# EAGLE schematic gameoflife (EAGLE 7.3.0)
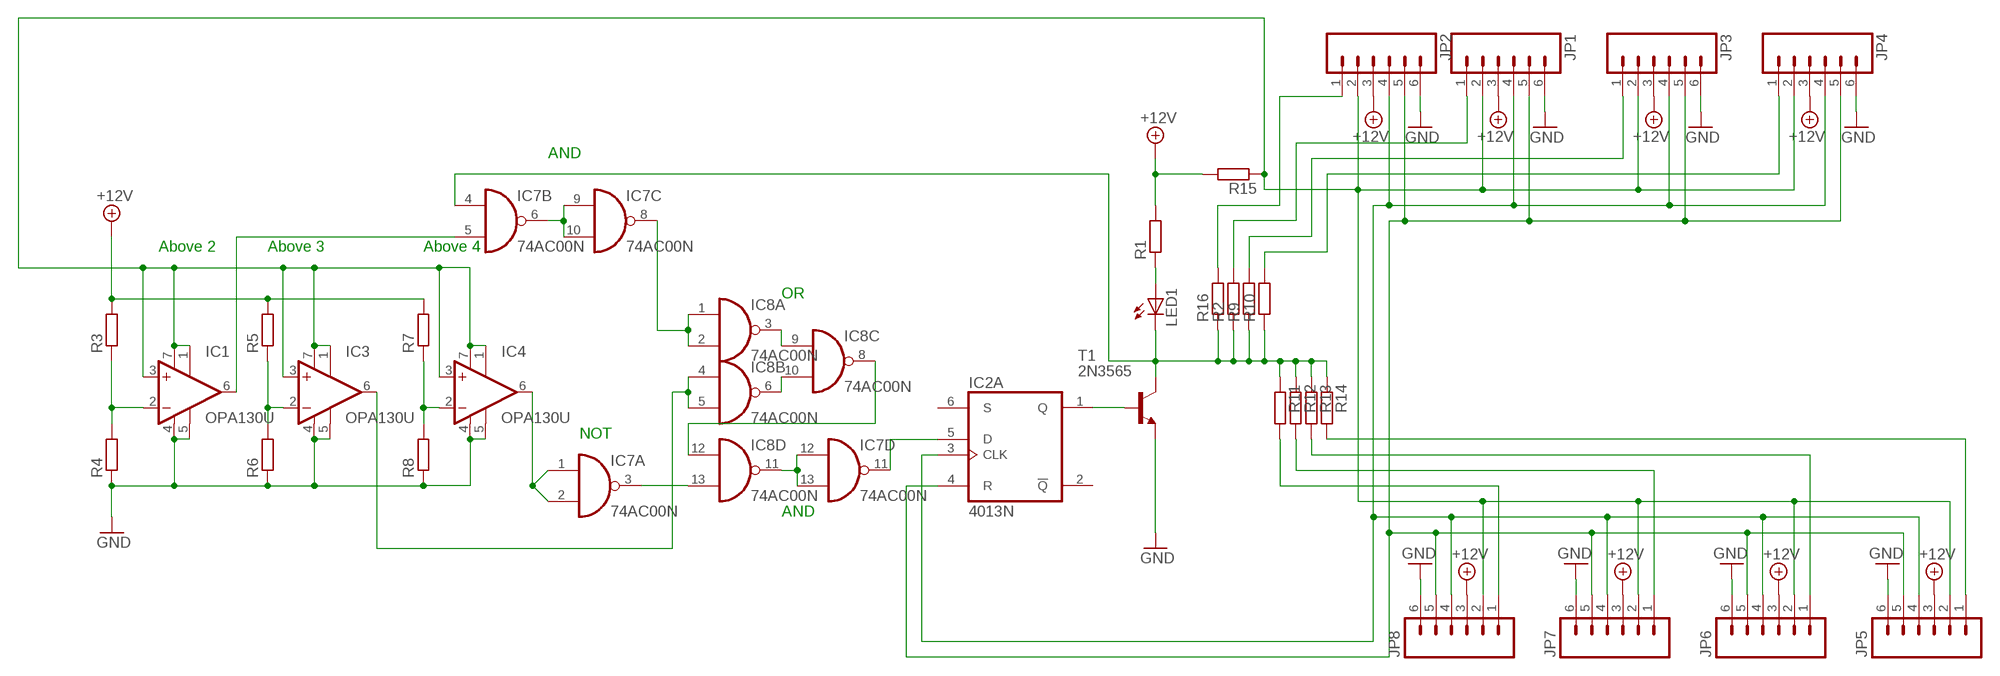
[diagram p0: schematic, sheet 1]

## Parts
IC1  OPA130U  [SO08]
IC2  4013N  [DIL14]
IC3  OPA130U  [SO08]
IC4  OPA130U  [SO08]
IC7  74AC00N  [DIL14]
IC8  74AC00N  [DIL14]
JP1  M06SILK_FEMALE_PTH  [1X06]
JP2  M06SILK_FEMALE_PTH  [1X06]
JP3  M06SILK_FEMALE_PTH  [1X06]
JP4  M06SILK_FEMALE_PTH  [1X06]
JP5  M06SILK_FEMALE_PTH  [1X06]
JP6  M06SILK_FEMALE_PTH  [1X06]
JP7  M06SILK_FEMALE_PTH  [1X06]
JP8  M06SILK_FEMALE_PTH  [1X06]
LED1  LED3MM  [LED3MM]
R1  R-EU_0207/10  [0207/10]
R2  R-EU_0207/10  [0207/10]
R3  R-EU_0207/10  [0207/10]
R4  R-EU_0207/10  [0207/10]
R5  R-EU_0207/10  [0207/10]
R6  R-EU_0207/10  [0207/10]
R7  R-EU_0207/10  [0207/10]
R8  R-EU_0207/10  [0207/10]
R9  R-EU_0207/10  [0207/10]
R10  R-EU_0207/10  [0207/10]
R11  R-EU_0207/10  [0207/10]
R12  R-EU_0207/10  [0207/10]
R13  R-EU_0207/10  [0207/10]
R14  R-EU_0207/10  [0207/10]
R15  R-EU_0207/10  [0207/10]
R16  R-EU_0207/10  [0207/10]
T1  2N3565  [TO92]

## Nets
+12V: JP1.3 JP2.3 JP3.3 JP4.3 JP5.3 JP6.3 JP7.3 JP8.3 R1.2 R3.2 R5.2 R7.2 R15.2
GND: IC1.4(V-) IC1.5(TRIM2) IC3.4(V-) IC3.5(TRIM2) IC4.4(V-) IC4.5(TRIM2) JP1.6 JP2.6 JP3.6 JP4.6 JP5.6 JP6.6 JP7.6 JP8.6 R4.1 R6.1 R8.1 T1.3(E)
N$1: IC7.4(B:I0) LED1.K(C) R2.1 R9.1 R10.1 R11.1 R12.1 R13.1 R14.1 R16.1 T1.1(C)
N$2: LED1.A R1.1
N$3: IC3.2(-IN) R5.1 R6.2
N$4: IC1.2(-IN) R3.1 R4.2
N$5: IC4.2(-IN) R7.1 R8.2
N$6: IC1.6(OUT) IC7.5(B:I1)
N$7: IC7.8(C:O) IC8.1(A:I0) IC8.2(A:I1)
N$8: JP2.1 R16.2
N$9: IC7.12(D:I0) IC7.13(D:I1) IC8.11(D:O)
N$10: IC8.8(C:O) IC8.12(D:I0)
N$11: IC4.6(OUT) IC7.1(A:I0) IC7.2(A:I1)
N$12: IC7.3(A:O) IC8.13(D:I1)
N$14: IC2.1(A:Q) T1.2(B)
N$15: IC2.5(A:D) IC7.11(D:O)
N$16: IC2.3(A:CLK) JP1.4 JP2.4 JP3.4 JP4.4 JP5.4 JP6.4 JP7.4 JP8.4
N$17: IC2.4(A:R) JP1.5 JP2.5 JP3.5 JP4.5 JP5.5 JP6.5 JP7.5 JP8.5
N$18: JP1.1 R2.2
N$19: JP3.1 R9.2
N$20: JP4.1 R10.2
N$21: IC3.6(OUT) IC8.4(B:I0) IC8.5(B:I1)
N$22: JP8.1 R11.2
N$23: JP7.1 R12.2
N$24: JP5.1 R14.2
N$25: JP6.1 R13.2
N$26: IC1.1(TRIM1) IC1.3(+IN) IC1.7(V+) IC3.1(TRIM1) IC3.3(+IN) IC3.7(V+) IC4.1(TRIM1) IC4.3(+IN) IC4.7(V+) JP1.2 JP2.2 JP3.2 JP4.2 JP5.2 JP6.2 JP7.2 JP8.2 R15.1
N$27: IC7.6(B:O) IC7.9(C:I0) IC7.10(C:I1)
N$28: IC8.6(B:O) IC8.10(C:I1)
N$29: IC8.3(A:O) IC8.9(C:I0)
Unconnected: IC2.2(A:!Q) IC2.6(A:S) IC2.8(B:S) IC2.9(B:D) IC2.10(B:R) IC2.11(B:CLK) IC2.12(B:!Q) IC2.13(B:Q)

## Notes on the sheet
- AND
- Above 2 | Above 3 | Above 4
- OR
- NOT
- AND

## Power pins joined to a net without a drawn wire
GND: IC7.7(P:GND) IC8.7(P:GND)
VCC: IC7.14(P:VCC) IC8.14(P:VCC)
VDD: IC2.14(P:VDD)
VSS: IC2.7(P:VSS)

## Library data of the parts
IC1 IC3 IC4 = burr-brown:OPA130: Operational Amplifiers Low Power, Precision FET-Input; MF: TEXAS INSTRUMENTS; MPN: OPA130UA; OC_FARNELL: 1577774; OC_NEWARK: 80K6006
IC2 = 40xx:4013: Dual D FLIP FLOP, set/reset
IC7 IC8 = 74xx-eu:74*00: Quad 2-input NAND gate
JP1-JP8 = SparkFun-Connectors:M06: Header 6 Standard 6-pin 0.1" header. Use with straight break away headers (SKU : PRT-00116), right angle break away headers (PRT-00553), swiss pins (PRT-00743), machine pins (PRT-00117), and female headers (PRT-00115). Molex polarized connector foot print use with SKU : PRT-08094 with associated crimp pins and housings. NOTES ON THE VARIANTS LOCK and LOCK_LONGPADS... This footprint was designed to help hold the alignment of a through-hole component (i.e. 6-pin header) while soldering it into place. You may notice that each hole has been shifted either up or down by 0.005 of an inch from it's more standard position (which is a perfectly straight line). This slight alteration caused the pins (the squares in the middle) to touch the edges of the holes. Because they are alternating, it causes a "brace" to hold the component in place. 0.005 has proven to be the perfect amount of "off-center" position when using our standard breakaway headers. Although looks a little odd when you look at the bare footprint, once you have a header in there, the alteration is very hard to notice. Also,if you push a header all the way into place, it is covered up entirely on the bottom side. This idea of altering the position of holes to aid alignment will be further integrated into the Sparkfun Library for other footprints. It can help hold any component with 3 or more connection pins.; PROD_ID: CONN-08437
LED1 = led:LED: LED OSRAM: - CHIPLED LG R971, LG N971, LY N971, LG Q971, LY Q971, LO R971, LY R971 LH N974, LH R974 LS Q976, LO Q976, LY Q976 LO Q996 - Hyper CHIPLED LW Q18S LB Q993, LB Q99A, LB R99A - SideLED LS A670, LO A670, LY A670, LG A670, LP A670 LB A673, LV A673, LT A673, LW A673 LH A674 LY A675 LS A676, LA A676, LO A676, LY A676, LW A676 LS A679, LY A679, LG A679 - Hyper Micro SIDELED® LS Y876, LA Y876, LO Y876, LY Y876 LT Y87S - SmartLED LW L88C, LW L88S LB L89C, LB L89S, LG L890 LS L89K, LO L89K, LY L89K LS L896, LA L896, LO L896, LY L896 - TOPLED LS T670, LO T670, LY T670, LG T670, LP T670 LSG T670, LSP T670, LSY T670, LOP T670, LYG T670 LG T671, LOG T671, LSG T671 LB T673, LV T673, LT T673, LW T673 LH T674 LS T676, LA T676, LO T676, LY T676, LB T676, LH T676, LSB T676, LW T676 LB T67C, LV T67C, LT T67C, LS T67K, LO T67K, LY T67K, LW E67C LS E67B, LA E67B, LO E67B, LY E67B, LB E67C, LV E67C, LT E67C LW T67C LS T679, LY T679, LG T679 LS T770, LO T770, LY T770, LG T770, LP T770 LB T773, LV T773, LT T773, LW T773 LH T774 LS E675, LA E675, LY E675, LS T675 LS T776, LA T776, LO T776, LY T776, LB T776 LHGB T686 LT T68C, LB T68C - Hyper Mini TOPLED® LB M676 - Mini TOPLED Santana® LG M470 LS M47K, LO M47K, LY M47K Source: http://www.osram.convergy.de LUXEON: - LUMILED® LXK2-PW12-R00, LXK2-PW12-S00, LXK2-PW14-U00, LXK2-PW14-V00 LXK2-PM12-R00, LXK2-PM12-S00, LXK2-PM14-U00 LXK2-PE12-Q00, LXK2-PE12-R00, LXK2-PE12-S00, LXK2-PE14-T00, LXK2-PE14-U00 LXK2-PB12-K00, LXK2-PB12-L00, LXK2-PB12-M00, LXK2-PB14-N00, LXK2-PB14-P00, LXK2-PB14-Q00 LXK2-PR12-L00, LXK2-PR12-M00, LXK2-PR14-Q00, LXK2-PR14-R00 LXK2-PD12-Q00, LXK2-PD12-R00, LXK2-PD12-S00 LXK2-PH12-R00, LXK2-PH12-S00 LXK2-PL12-P00, LXK2-PL12-Q00, LXK2-PL12-R00 Source: www.luxeon.com KINGBRIGHT: KA-3528ASYC Source: www.kingbright.com
R1-R16 = resistor:R-EU_: RESISTOR, European symbol
T1 = transistor:2N3565: NPN TRANSISTOR